# Altium schematic sheet PGA.SCHDOC
size B
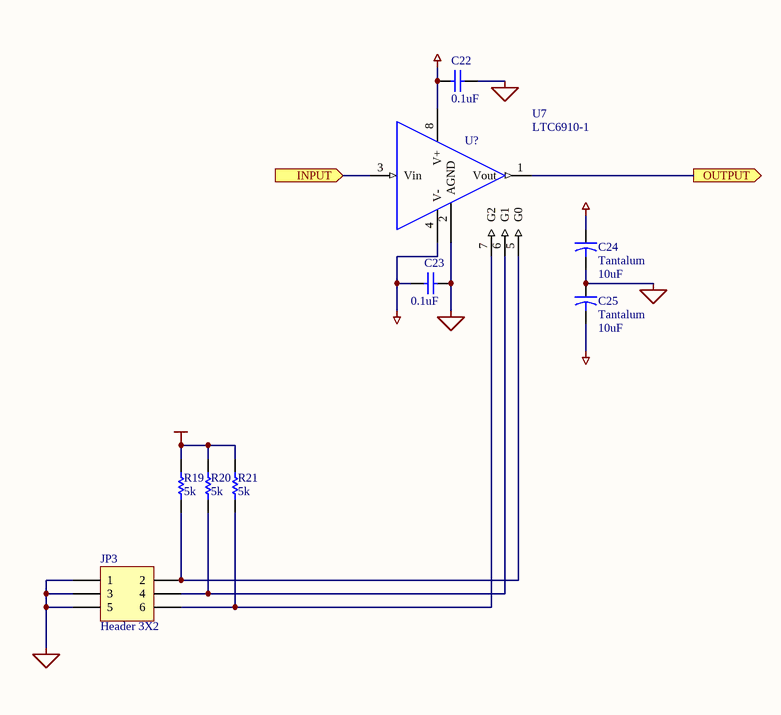
[diagram p0: PGA.SCHDOC]

## Parts
C22  value 0.1uF  [CC1608-0603]  (hidden comment: Cap)
C23  value 0.1uF  [CC1608-0603]  (hidden comment: Cap)
C24  Tantalum  value 10uF  [TC3216-1206]
C25  Tantalum  value 10uF  [TC3216-1206]
JP3  Header 3X2  [HDR2X3]
R19  value 5k  [CC2012-0805]  (hidden comment: Res1)
R20  value 5k  [CC2012-0805]  (hidden comment: Res1)
R21  value 5k  [CC2012-0805]  (hidden comment: Res1)
U7  LTC6910-1  [TSOT-23-8]

## Ports
INPUT (in), OUTPUT (out)

## Nets
AVDD: C22.1 C24.1 R19.2 R20.2 R21.2 U7.8(V+)
AVSS: C23.2 C25.2 U7.4(V-)
GND: C22.2 C23.1 C24.2 C25.1 JP3.1 JP3.3 JP3.5 U7.2(AGND)
INPUT: U7.3(Vin) ; port INPUT
OUTPUT: U7.1(Vout) ; port OUTPUT
NetJP3_2: JP3.2 R19.1 U7.5(G0)
NetJP3_4: JP3.4 R20.1 U7.6(G1)
NetJP3_6: JP3.6 R21.1 U7.7(G2)

## Notes on the sheet
- (in symbol LTC6910-2) U?

## Library data of the parts
C22 C23 = Cap: Capacitor; Manufacturer: Generic Components; Class I: Passive; Published: 8-Jun-2000; Revision: July-2002: Re-released for DXP Platform.; Publisher: Altium Limited; Class II: Capacitor
C24 C25 = Cap2: Capacitor; Manufacturer: Generic Components; Class I: Passive; Published: 23-Sep-2002; Publisher: Altium Limited; Class II: Capacitor
JP3 = Header 3X2: Header, 3-Pin, Dual row; Manufacturer: Generic Components; Class I: Connector; Revision: July-2002: Re-released for DXP Platform.; Publisher: Altium Limited
R19-R21 = Res1: Resistor; Manufacturer: Generic Components; Class I: Passive; Published: 8-Jun-2000; Revision: July-2002: Re-released for DXP Platform.; Publisher: Altium Limited; Class II: Resistor
U7 = LTC6910-2: LTI Digitally Controlled Programmabe Gain Amp